# EAGLE design PCB (EAGLE 8.3.1)
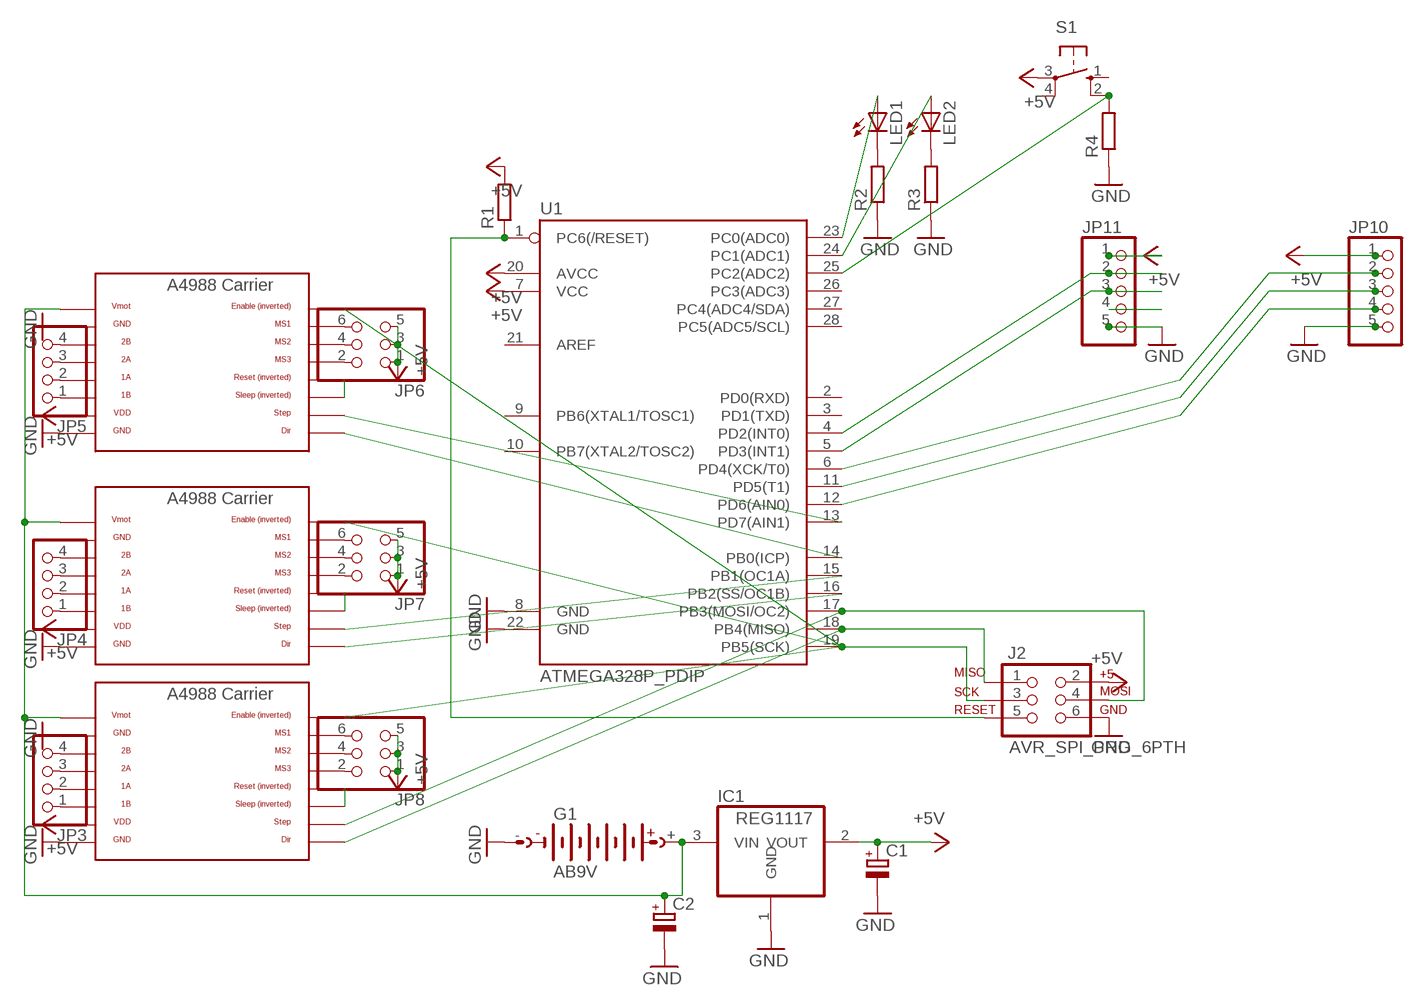
[diagram p0: schematic, sheet 1]

## Parts
C1  CPOL-EUE3.5-8  [E3,5-8]
C2  CPOL-EUE3.5-8  [E3,5-8]
G1  AB9V  [AB9V]
IC1  REG1117  [SOT223]
J2  AVR_SPI_PRG_6PTH  [2X3]
JP3  PINHD-1X4  [1X04]
JP4  PINHD-1X4  [1X04]
JP5  PINHD-1X4  [1X04]
JP6  PINHD-2X3  [2X03]
JP7  PINHD-2X3  [2X03]
JP8  PINHD-2X3  [2X03]
JP10  PINHD-1X5  [1X05]
JP11  PINHD-1X5  [1X05]
LED1  LED5MM  [LED5MM]
LED2  LED5MM  [LED5MM]
R1  R-EU_0207/10  [0207/10]
R2  R-EU_0207/10  [0207/10]
R3  R-EU_0207/10  [0207/10]
R4  R-EU_0207/10  [0207/10]
S1  10-XX  [B3F-10XX]
U1  ATMEGA328P_PDIP  [DIL28-3]
U$1  A4988BREAKOUT  [A4988BREAKOUT]
U$2  A4988BREAKOUT  [A4988BREAKOUT]
U$4  A4988BREAKOUT  [A4988BREAKOUT]

## Nets
+5V: C1.+ IC1.2(VOUT) J2.2 JP6.1 JP6.3 JP6.5 JP7.1 JP7.3 JP7.5 JP8.1 JP8.3 JP8.5 JP10.1 JP11.1 R1.2 S1.3(P) U1.7(VCC) U1.20(AVCC) U$1.VDD U$2.VDD U$4.VDD
GND: C1.- C2.- G1.- IC1.1(GND) J2.6 JP10.5 JP11.5 R2.1 R3.1 R4.1 U1.8(GND) U1.22(GND) U$1.GND@0(GND) U$2.GND U$2.GND@0(GND) U$4.GND U$4.GND@0(GND)
N$1: U$1.RST U$1.SLP(SLEEP)
N$2: U$2.RST U$2.SLP(SLEEP)
N$3: C2.+ G1.+ IC1.3(VIN) U$1.VMOT U$2.VMOT U$4.VMOT
N$4: J2.1 U1.18(PB4(MISO)) U$2.DIR
N$5: J2.3 U1.19(PB5(SCK)) U$1.EN U$2.EN U$4.EN
N$6: J2.4 U1.17(PB3(MOSI/OC2)) U$2.STEP
N$7: J2.5 R1.1 U1.1(PC6(/RESET))
N$8: JP3.1 U$2.1B
N$9: JP3.2 U$2.1A
N$10: JP3.3 U$2.2A
N$11: JP3.4 U$2.2B
N$12: JP4.1 U$1.1B
N$13: JP4.2 U$1.1A
N$14: JP4.3 U$1.2A
N$15: JP4.4 U$1.2B
N$16: JP5.1 U$4.1B
N$17: JP5.2 U$4.1A
N$18: JP5.3 U$4.2A
N$19: JP5.4 U$4.2B
N$20: JP6.2 U$4.MS3
N$21: JP6.4 U$4.MS2
N$22: JP6.6 U$4.MS1
N$23: JP7.2 U$1.MS3
N$24: JP7.4 U$1.MS2
N$25: JP7.6 U$1.MS1
N$26: JP8.2 U$2.MS3
N$27: JP8.4 U$2.MS2
N$28: JP8.6 U$2.MS1
N$29: JP11.4
N$32: JP11.2 U1.4(PD2(INT0))
N$33: JP11.3 U1.5(PD3(INT1))
N$34: JP10.2 U1.6(PD4(XCK/T0))
N$35: JP10.3 U1.11(PD5(T1))
N$36: JP10.4 U1.12(PD6(AIN0))
N$37: U1.13(PD7(AIN1)) U$4.STEP
N$38: U1.14(PB0(ICP)) U$4.DIR
N$39: U$4.RST U$4.SLP(SLEEP)
N$40: U1.15(PB1(OC1A)) U$1.STEP
N$41: U1.16(PB2(SS/OC1B)) U$1.DIR
N$42: LED1.A U1.23(PC0(ADC0))
N$43: LED2.A U1.24(PC1(ADC1))
N$44: LED1.K(C) R2.2
N$45: LED2.K(C) R3.2
N$46: R4.2 S1.2(S1) U1.25(PC2(ADC2))
Unconnected: S1.1(S) S1.4(P1) U1.2(PD0(RXD)) U1.3(PD1(TXD)) U1.9(PB6(XTAL1/TOSC1)) U1.10(PB7(XTAL2/TOSC2)) U1.21(AREF) U1.26(PC3(ADC3)) U1.27(PC4(ADC4/SDA)) U1.28(PC5(ADC5/SCL))

## Power pins joined to a net without a drawn wire
GND: U$1.GND

## Library data of the parts
C1 C2 = rcl:CPOL-EU: POLARIZED CAPACITOR, European symbol
G1 = battery:AB9V: 9-V BATTERY CLIP
IC1 = burr-brown:REG1117: 800mA and 1A Low Dropout (LDO) Positive Regulator 1.8V, 2.5V, 2.85V, 3.3V, 5V, and Adj; MPN: REG1117; OC_FARNELL: 1097566; OC_NEWARK: 14P6981
J2 = SparkFun-Connectors:AVR_SPI_PRG_6: AVR ISP 6 Pin This is the reduced ISP connector for AVR programming. Common on Arduino. This footprint will take up less PCB space and can be used with a 10-pin to 6-pin adapter such as SKU: BOB-08508 **Special note about "TEST_POINT" package. The stop mask is on the top side, so if you want your programming test points to be on the bottom of your board, make sure to place this package on the bottom side of the board. This also ensure that the orientation to program from the bottom side will be correct.
JP3-JP5 = pinhead:PINHD-1X4: PIN HEADER
JP6-JP8 = pinhead:PINHD-2X3: PIN HEADER
JP10 JP11 = pinhead:PINHD-1X5: PIN HEADER
LED1 LED2 = led:LED: LED OSRAM: - CHIPLED LG R971, LG N971, LY N971, LG Q971, LY Q971, LO R971, LY R971 LH N974, LH R974 LS Q976, LO Q976, LY Q976 LO Q996 - Hyper CHIPLED LW Q18S LB Q993, LB Q99A, LB R99A - SideLED LS A670, LO A670, LY A670, LG A670, LP A670 LB A673, LV A673, LT A673, LW A673 LH A674 LY A675 LS A676, LA A676, LO A676, LY A676, LW A676 LS A679, LY A679, LG A679 - Hyper Micro SIDELED® LS Y876, LA Y876, LO Y876, LY Y876 LT Y87S - SmartLED LW L88C, LW L88S LB L89C, LB L89S, LG L890 LS L89K, LO L89K, LY L89K LS L896, LA L896, LO L896, LY L896 - TOPLED LS T670, LO T670, LY T670, LG T670, LP T670 LSG T670, LSP T670, LSY T670, LOP T670, LYG T670 LG T671, LOG T671, LSG T671 LB T673, LV T673, LT T673, LW T673 LH T674 LS T676, LA T676, LO T676, LY T676, LB T676, LH T676, LSB T676, LW T676 LB T67C, LV T67C, LT T67C, LS T67K, LO T67K, LY T67K, LW E67C LS E67B, LA E67B, LO E67B, LY E67B, LB E67C, LV E67C, LT E67C LW T67C LS T679, LY T679, LG T679 LS T770, LO T770, LY T770, LG T770, LP T770 LB T773, LV T773, LT T773, LW T773 LH T774 LS E675, LA E675, LY E675, LS T675 LS T776, LA T776, LO T776, LY T776, LB T776 LHGB T686 LT T68C, LB T68C - Hyper Mini TOPLED® LB M676 - Mini TOPLED Santana® LG M470 LS M47K, LO M47K, LY M47K Source: http://www.osram.convergy.de LUXEON: - LUMILED® LXK2-PW12-R00, LXK2-PW12-S00, LXK2-PW14-U00, LXK2-PW14-V00 LXK2-PM12-R00, LXK2-PM12-S00, LXK2-PM14-U00 LXK2-PE12-Q00, LXK2-PE12-R00, LXK2-PE12-S00, LXK2-PE14-T00, LXK2-PE14-U00 LXK2-PB12-K00, LXK2-PB12-L00, LXK2-PB12-M00, LXK2-PB14-N00, LXK2-PB14-P00, LXK2-PB14-Q00 LXK2-PR12-L00, LXK2-PR12-M00, LXK2-PR14-Q00, LXK2-PR14-R00 LXK2-PD12-Q00, LXK2-PD12-R00, LXK2-PD12-S00 LXK2-PH12-R00, LXK2-PH12-S00 LXK2-PL12-P00, LXK2-PL12-Q00, LXK2-PL12-R00 Source: www.luxeon.com KINGBRIGHT: KA-3528ASYC Source: www.kingbright.com
R1-R4 = resistor:R-EU_: RESISTOR, European symbol
S1 = switch-omron:10-XX: OMRON SWITCH; MPN: B3F-1000; OC_FARNELL: 176432; OC_NEWARK: 36M3542
U1 = SparkFun-DigitalIC:ATMEGA328P_PDIP: uC used in the Arduino 32kb flash, 1k EEPROM, 2k SRAM This is the through-hole version of this chip.
U$1 U$2 U$4 = RepRapjr:A4988BREAKOUT

## Board
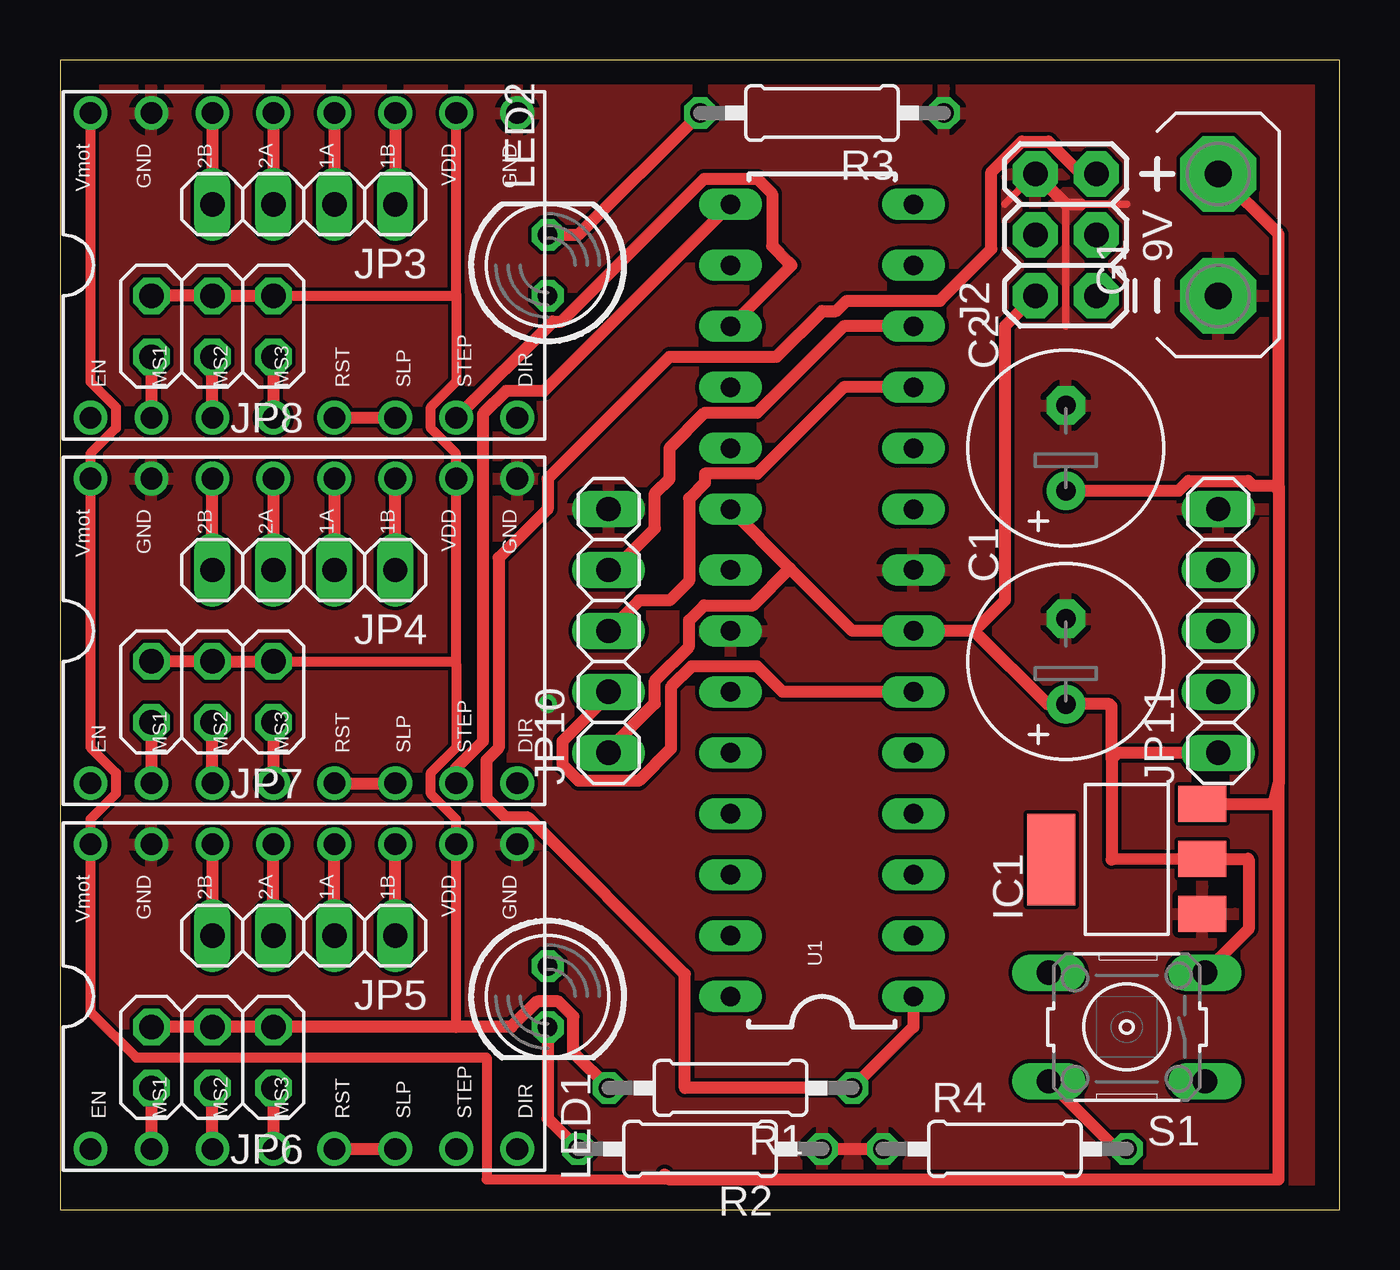
[diagram p1: board, top side]
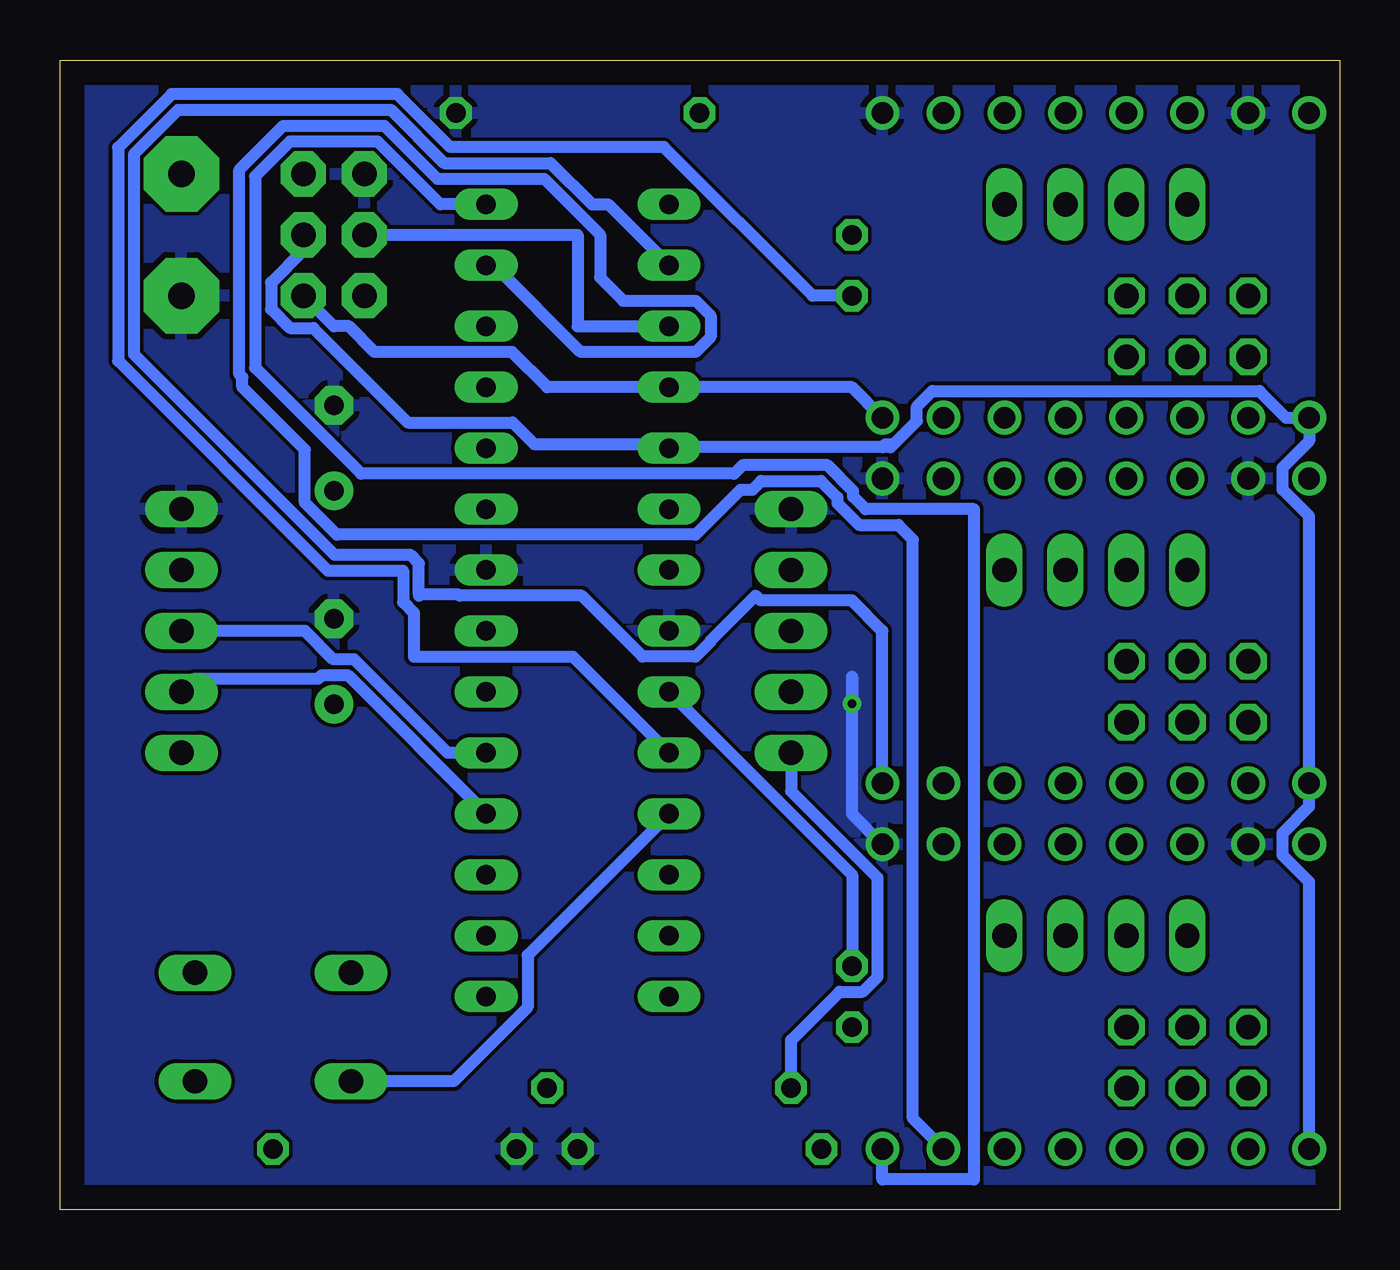
[diagram p2: board, bottom side, seen from below]

Size 53.32 x 47.93 mm. Coordinates in mm from the lower left corner, seen from the top.
Outline: 0,0 53.32,0 53.32,47.93 0,47.93 0,0
Copper layers (1*16): Top 0.035mm / dielectric 1.5mm / Bottom 0.035mm
Design rules "default": minimum track width 6mil, minimum drill 0.35mm, track to track 6mil, track to pad 6mil, pad to pad 6mil, via to via 6mil, smd to smd 6mil, copper to edge 40mil, drill to drill 6mil, minimum pad ring 10mil, minimum via ring 8mil, stop-mask expansion 4mil, vias tented up to drill 0mil, thermal gap 10mil

### Footprints (pad centres in the part's own frame; a part is rotated, then mirrored left to right if it is on the bottom)
E3,5-8 = drill 0.813 pad 1.6: + -1.778,0 | drill 0.813 pad 1.6 octagon: - 1.778,0
AB9V = drill 1.118 pad 3.15 octagon: + 0,2.54; - 0,-2.54
SOT223 = smd 1.499 x 2.007: 1 -2.261,-3.15; 2 0.025,-3.15; 3 2.311,-3.15 | smd 3.81 x 2.007: 4 0,3.15
2X3 = drill 1.016 pad 1.88 octagon: 1 0,0; 2 0,2.54; 3 2.54,0; 4 2.54,2.54; 5 5.08,0; 6 5.08,2.54
1X04 = drill 1.016 long: 1 -3.81,0; 2 -1.27,0; 3 1.27,0; 4 3.81,0
2X03 = drill 1.016 octagon: 1 -2.54,-1.27; 2 -2.54,1.27; 3 0,-1.27; 4 0,1.27; 5 2.54,-1.27; 6 2.54,1.27
1X05 = drill 1.016 long: 1 -5.08,0; 2 -2.54,0; 3 0,0; 4 2.54,0; 5 5.08,0
LED5MM = drill 0.813 octagon: A -1.27,0; K 1.27,0
0207/10 = drill 0.813 octagon: 1 -5.08,0; 2 5.08,0
B3F-10XX = drill 1.016 long: 1 -3.251,2.261; 2 3.251,2.261; 3 -3.251,-2.261; 4 3.251,-2.261
DIL28-3 = drill 0.813 long: 1 -16.51,-3.81; 2 -13.97,-3.81; 3 -11.43,-3.81; 4 -8.89,-3.81; 5 -6.35,-3.81; 6 -3.81,-3.81; 7 -1.27,-3.81; 8 1.27,-3.81; 9 3.81,-3.81; 10 6.35,-3.81; 11 8.89,-3.81; 12 11.43,-3.81; 13 13.97,-3.81; 14 16.51,-3.81; 15 16.51,3.81; 16 13.97,3.81; 17 11.43,3.81; 18 8.89,3.81; 19 6.35,3.81; 20 3.81,3.81; 21 1.27,3.81; 22 -1.27,3.81; 23 -3.81,3.81; 24 -6.35,3.81; 25 -8.89,3.81; 26 -11.43,3.81; 27 -13.97,3.81; 28 -16.51,3.81
A4988BREAKOUT = drill 0.9: 1A 8.89,1.27; 1B 11.43,1.27; 2A 6.35,1.27; 2B 3.81,1.27; DIR 16.51,-11.43; EN -1.27,-11.43; GND 16.51,1.27; GND@0 1.27,1.27; MS1 1.27,-11.43; MS2 3.81,-11.43; MS3 6.35,-11.43; RST 8.89,-11.43; SLP 11.43,-11.43; STEP 13.97,-11.43; VDD 13.97,1.27; VMOT -1.27,1.27

### Placement (x,y rotation side)
C1  41.91,22.86 90 top
C2  41.91,31.75 90 top
G1  48.26,40.64 0 top
IC1  44.45,14.61 90 top
J2  43.18,38.1 90 top
JP3  10.16,41.91 180 top
JP4  10.16,26.67 180 top
JP5  10.16,11.43 180 top
JP6  6.35,6.35 180 top
JP7  6.35,21.59 180 top
JP8  6.35,36.83 180 top
JP10  22.86,24.13 90 top
JP11  48.26,24.13 90 top
LED1  20.32,8.89 270 top
LED2  20.32,39.37 90 top
R1  27.94,5.08 180 top
R2  26.67,2.54 180 top
R3  31.75,45.72 180 top
R4  39.37,2.54 0 top
S1  44.45,7.62 180 top
U1  31.75,25.4 90 top
U$1  2.54,29.21 0 top
U$2  2.54,44.45 0 top
U$4  2.54,13.97 0 top

### Tracks (layer width: path | path; a pad name or v marks a point on that pad's centre or on a via)
+5V
  Top 0.406: 16.51,7.62 U$4.VDD 16.51,16.28 15.45,17.34 15.45,18.22 16.51,19.28 16.51,22.75 | 16.51,22.75 U$1.VDD 16.51,31.52 15.45,32.58 15.45,33.46 16.51,34.52 16.51,38.2 | 16.51,38.2 U$2.VDD | JP8.1 16.41,38.1 16.51,38.2 | JP7.1 16.4,22.86 16.51,22.75
  Top 0.508: JP8.1 JP8.3 JP8.5 | JP7.1 JP7.3 JP7.5 | JP6.5 JP6.3 JP6.1 16.51,7.62 18.81,7.62 19.88,8.69 20.76,8.69 21.39,8.06 21.39,6.55 R1.2 | 43.81,18.8 43.81,14.61 IC1.2 49.51,14.63 49.53,14.61 49.53,11.71 S1.3 | 43.81,18.8 43.81,20.99 43.72,21.08 C1.+ 41.15,21.08 38.1,24.13 | 38.1,24.13 U1.7 33.02,24.13 30.41,26.74 | 30.41,26.74 U1.20 27.94,28.84 | J2.2 39.37,36.83 39.37,25.4 38.1,24.13 | 30.41,26.74 28.88,25.2 26.84,25.2 26.21,24.57 26.21,23.48 24.79,22.06 24.79,21.11 22.86,19.18 JP10.1 | JP11.1 44.06,19.05 43.81,18.8
  Bottom 0.508: R1.2 22.86,7.07 20.83,9.09 19.88,9.09 19.25,9.72 19.25,13.84 22.86,17.44 JP10.1 | 48.9,19.05 JP11.1
GND  (via drill 0.35)
  Top 0.305: 42.55,41.91 44.45,41.91 | 41.91,41.91 41.91,36.83 | J2.6 39.37,41.91
  Top 0.508: R2.1 R4.1 | J2.6 41.91,41.91 42.55,41.91
  Bottom 0.508: U$4.GND 20.32,16.51 v20.32,21.1 | v20.32,21.1 20.32,22.22 v20.32,21.1
  pour Top: 0,48.26 53.34,48.26 53.34,0 0,0
  pour Bottom: 0,48.26 53.34,48.26 53.34,0 0,0
N$1
  Top 0.508: U$1.RST U$1.SLP
N$2
  Top 0.508: U$2.RST U$2.SLP
N$3
  Top 0.406: U$2.VMOT 1.27,34.52 2.33,33.46 2.33,32.58 1.27,31.52 U$1.VMOT 1.27,19.28 2.33,18.22 2.33,17.34 1.27,16.28 U$4.VMOT 1.27,8.26 3.17,6.35 17.78,6.35 17.78,1.27 25.4,1.27
  Top 0.508: IC1.3 50.57,16.92 50.78,17.76 | 50.78,29.96 50.78,17.76 | 50.78,30.18 50.78,29.96 | 50.78,30.18 50.78,40.66 G1.+ | 50.77,29.97 50.78,29.96 | 25.2,1.47 25.4,1.27 50.78,1.27 50.78,17.76 | C2.+ 46.61,29.97 47.01,30.38 49.51,30.38 49.7,30.18 50.78,30.18
N$4
  Bottom 0.508: U$2.DIR 20.32,34.29 U1.18 33.02,34.29 34.49,35.76 40.21,35.76 41.27,36.83 41.91,36.83 J2.1
N$5
  Bottom 0.508: U$4.EN 1.27,13.67 2.38,14.78 2.38,15.7 1.27,16.81 U$1.EN 1.27,28.91 2.38,30.02 2.38,30.94 1.27,32.05 U$2.EN 1.84,33.02 2.24,33.02 3.35,34.13 16.97,34.13 17.62,33.48 17.62,32.88 18.59,31.91 18.93,31.91 19.05,31.79 | 27.83,31.86 27.78,31.91 33.55,31.91 34.46,32.82 38.83,32.82 42.77,36.75 43.74,36.75 44.53,37.54 44.53,38.66 43.18,40 J2.3 | 27.83,31.86 U1.19 | 18.71,31.79 19.05,31.79 | 19.05,31.79 27.76,31.79 27.83,31.86
N$6
  Top 0.508: U$2.STEP 20.52,37.03 20.89,37.03 26.84,42.98 29.04,42.98 29.67,42.35 29.67,40.18 30.36,39.49 | 30.36,39.49 30.48,39.37 | U1.17 30.36,39.26 30.36,39.49
  Bottom 0.508: J2.4 31.75,40.64 31.75,36.83 U1.17
N$7
  Top 0.508: U1.1 35.56,7.62 R1.1 26.04,5.08 26.04,9.82 19.51,16.35 18.57,16.35 17.78,17.14 17.78,18.75 18.28,19.25 18.28,27.17 20.32,29.21 20.32,30.48 25.4,35.56 29.84,35.56 31.75,37.47 32.35,37.47 32.78,37.9 36.66,37.9 38.81,40.05 38.81,43.26 40.08,44.53 41.2,44.53 42.54,43.18 J2.5
N$8
  Top 0.508: U$2.1B JP3.1
N$9
  Top 0.508: U$2.1A JP3.2
N$10
  Top 0.508: U$2.2A JP3.3
N$11
  Top 0.508: U$2.2B JP3.4
N$12
  Top 0.508: JP4.1 U$1.1B
N$13
  Top 0.508: U$1.1A JP4.2
N$14
  Top 0.508: U$1.2A JP4.3
N$15
  Top 0.508: JP4.4 U$1.2B
N$16
  Top 0.508: JP5.1 U$4.1B
N$17
  Top 0.508: JP5.2 U$4.1A
N$18
  Top 0.508: JP5.3 U$4.2A
N$19
  Top 0.508: U$4.2B JP5.4
N$20
  Top 0.508: JP6.2 U$4.MS3
N$21
  Top 0.508: U$4.MS2 JP6.4
N$22
  Top 0.508: JP6.6 U$4.MS1
N$23
  Top 0.508: JP7.2 U$1.MS3
N$24
  Top 0.508: U$1.MS2 JP7.4
N$25
  Top 0.508: JP7.6 U$1.MS1
N$26
  Top 0.508: JP8.2 U$2.MS3
N$27
  Top 0.508: U$2.MS2 JP8.4
N$28
  Top 0.508: JP8.6 U$2.MS1
N$32
  Bottom 0.508: U1.4 41.34,22.29 42.41,22.29 42.57,22.13 47.72,22.13 JP11.2
N$33
  Bottom 0.508: JP11.3 43.11,24.13 41.93,22.95 41.06,22.95 37.17,19.05 U1.5
N$34
  Top 0.508: U1.6 30.11,21.59 29.04,22.66 26.32,22.66 25.45,21.79 25.45,19.23 24.11,17.88 21.61,17.88 20.93,18.57 20.93,19.53 22.86,21.46 JP10.2
N$35
  Top 0.508: U1.11 32.65,34.29 29.04,30.68 26.87,30.68 26.87,30.31 26.21,29.65 26.21,26.21 25.4,25.4 24.13,25.4 JP10.3
N$36
  Top 0.508: U1.12 32.65,36.83 29.04,33.22 26.87,33.22 25.4,31.75 25.4,30.48 24.79,29.87 24.79,28.41 23.91,27.53 | 22.86,26.48 23.91,27.53 | 23.91,27.53 23.05,26.67 JP10.4
N$37
  Bottom 0.508: U$4.STEP 17.78,3.81 17.78,27.94 18.39,28.55 20.02,28.55 20.93,29.46 20.93,29.69 21.61,30.38 24.11,30.38 24.46,30.02 24.96,30.02 26.84,28.14 41.79,28.14 43.12,29.47 43.12,31.69 45.72,34.29 45.72,34.7 45.85,34.83 45.85,43.35 44.01,45.19 39.81,45.19 37.6,42.98 33.15,42.98 30.82,40.64 30.82,38.86 29.86,37.9 26.84,37.9 26.21,37.27 26.21,36.39 26.84,35.76 31.62,35.76 35.22,39.37 U1.13
N$38
  Bottom 0.508: U1.14 37.47,41.91 40.08,44.53 43.74,44.53 45.19,43.08 45.19,35.1 40.77,30.68 25.23,30.68 24.88,31.04 21.34,31.04 20.27,29.97 20.27,29.73 19.75,29.21 15.24,29.21 15.24,1.27 19.05,1.27 U$4.DIR
N$39
  Top 0.508: U$4.RST U$4.SLP
N$40
  Top 0.508: U$1.STEP 16.51,18.42 17.62,19.53 17.62,33.16 18.59,34.13 20.16,34.13 U1.15
N$41
  Bottom 0.508: U1.16 30.48,41.91 31.15,41.91 32.88,43.64 37.33,43.64 39.53,45.85 48.4,45.85 50.24,44 50.24,35.66 41.88,27.3 38.73,27.3 38.36,26.93 38.36,25.64 | U$1.DIR 19.05,24.13 20.32,25.4 24.13,25.4 24.33,25.6 26.21,23.72 26.21,23.69 26.84,23.06 29.04,23.06 31.58,25.6 36.66,25.6 36.7,25.64 38.36,25.64 | 38.36,25.64 38.36,25.6
N$42
  Bottom 0.508: U1.23 20.32,13.97 LED1.A
N$43
  Bottom 0.508: LED2.A 21.96,38.1 28.16,44.3 37.05,44.3 39.26,46.51 48.67,46.51 50.9,44.27 50.9,35.39 42.16,26.64 39.02,26.64 39.02,25.33 38.58,24.88 38.58,23.06 31.95,23.06 U1.24
N$44
  Top 0.508: LED1.K 20.32,3.81 R2.2
N$45
  Top 0.508: LED2.K 21.59,40.64 R3.2
N$46
  Top 0.508: R4.2 44.02,2.54 S1.2
  Bottom 0.508: U1.25 33.83,10.62 33.83,8.45 36.92,5.36 S1.2